# EAGLE design G228 (EAGLE 4.11)
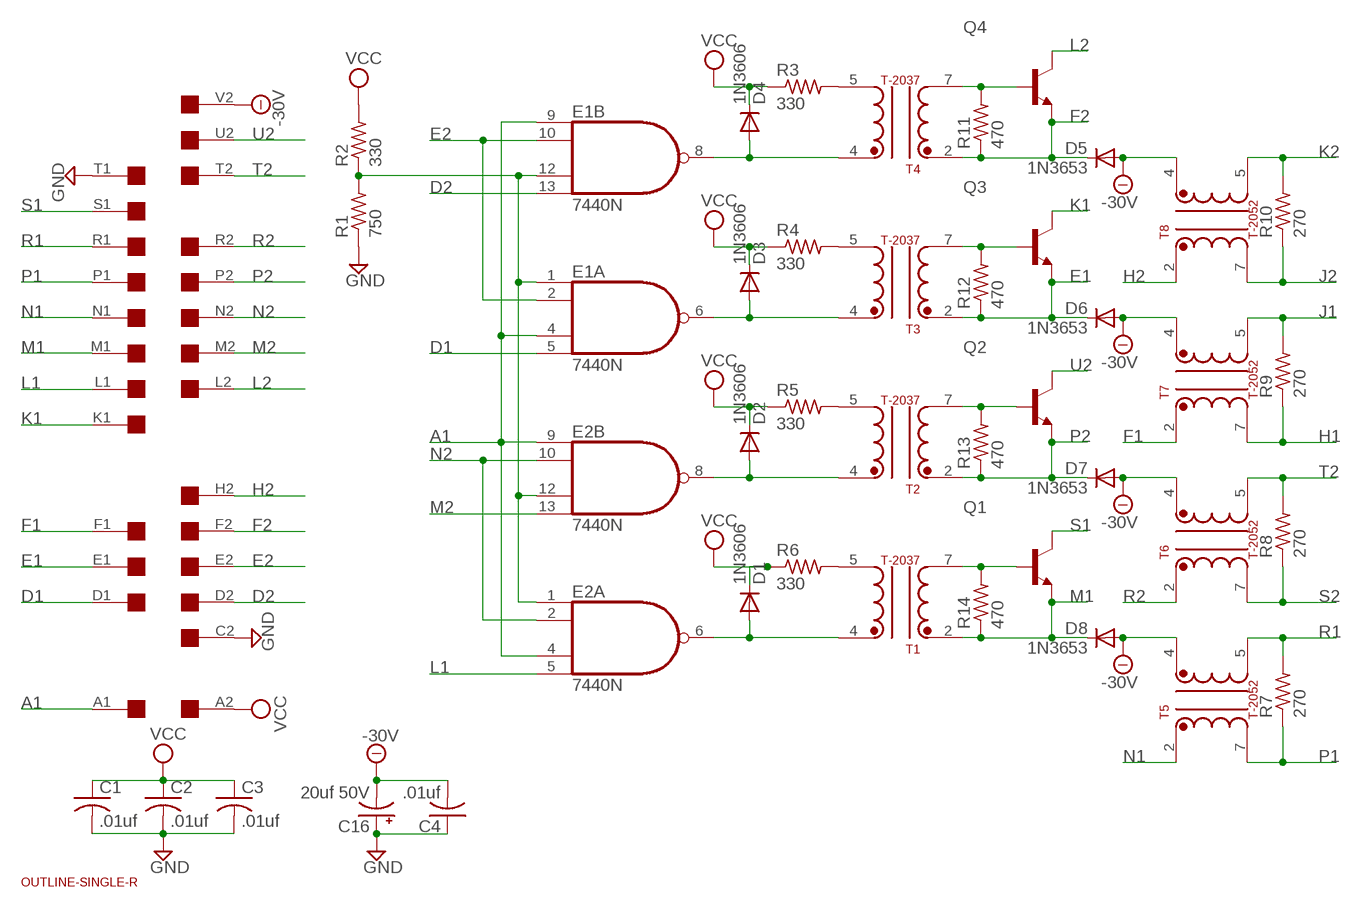
[diagram p0: schematic, sheet 1]

## Parts
C1  .01uf  C-US050-025X075  [C050-025X075]
C2  .01uf  C-US050-025X075  [C050-025X075]
C3  .01uf  C-US050-025X075  [C050-025X075]
C4  .01uf  C-US050-025X075  [C050-025X075]
C16  20uf 50V  CPOL-USE15-5AXIAL  [E15-5]
D1  1N3606  1N4148  [DO35-10]
D2  1N3606  1N4148  [DO35-10]
D3  1N3606  1N4148  [DO35-10]
D4  1N3606  1N4148  [DO35-10]
D5  1N3653  1N4148  [DO35-10]
D6  1N3653  1N4148  [DO35-10]
D7  1N3653  1N4148  [DO35-10]
D8  1N3653  1N4148  [DO35-10]
E1  7440N  74S20N  [DIL14]
E2  7440N  74S20N  [DIL14]
Q1  2N1613-NPN-TO39-EBC  [TO39]
Q2  2N1613-NPN-TO39-EBC  [TO39]
Q3  2N1613-NPN-TO39-EBC  [TO39]
Q4  2N1613-NPN-TO39-EBC  [TO39]
R1  750  R-US_0207/10  [0207/10]
R2  330  R-US_0207/10  [0207/10]
R3  330  R-US_0207/10  [0207/10]
R4  330  R-US_0207/10  [0207/10]
R5  330  R-US_0207/10  [0207/10]
R6  330  R-US_0207/10  [0207/10]
R7  270  R-US_0207/10  [0207/10]
R8  270  R-US_0207/10  [0207/10]
R9  270  R-US_0207/10  [0207/10]
R10  270  R-US_0207/10  [0207/10]
R11  470  R-US_0207/10  [0207/10]
R12  470  R-US_0207/10  [0207/10]
R13  470  R-US_0207/10  [0207/10]
R14  470  R-US_0207/10  [0207/10]
T1  T-2037  [TRANSFORMER]
T2  T-2037  [TRANSFORMER]
T3  T-2037  [TRANSFORMER]
T4  T-2037  [TRANSFORMER]
T5  T-2052  [TRANSFORMER]
T6  T-2052  [TRANSFORMER]
T7  T-2052  [TRANSFORMER]
T8  T-2052  [TRANSFORMER]
U$1  SINGLE  [EDGE-CON2]
U$2  OUTLINE-SINGLE-R  [SINGLE-R]

## Nets
-24V [supply]: C4.2 C16.- D5.A D6.A D7.A D8.A T5.4 T6.4 T7.4 T8.4 U$1.V2 ; supply symbol labelled -30V
A1: E1.4(A:I2) E1.9(B:I0) E2.4(A:I2) E2.9(B:I0) U$1.A1
D1: E1.5(A:I3) U$1.D1
D2: E1.13(B:I3) U$1.D2
E1: D6.C Q3.1(E) R12.1 T3.2 U$1.E1
E2: E1.2(A:I1) E1.10(B:I1) U$1.E2
F1: T7.2 U$1.F1
F2: D5.C Q4.1(E) R11.1 T4.2 U$1.F2
GND [supply]: C1.2 C2.2 C3.2 C4.1 C16.+ R1.1 U$1.C2 U$1.T1
H1: R9.1 T7.7
H2: T8.2 U$1.H2
J1: R9.2 T7.5
J2: R10.1 T8.7
K1: Q3.3(C) U$1.K1
K2: R10.2 T8.5
L1: E2.5(A:I3) U$1.L1
L2: Q4.3(C) U$1.L2
M1: D8.C Q1.1(E) R14.1 T1.2 U$1.M1
M2: E2.13(B:I3) U$1.M2
N1: T5.2 U$1.N1
N2: E2.2(A:I1) E2.10(B:I1) U$1.N2
N$1: E1.1(A:I0) E1.12(B:I2) E2.1(A:I0) E2.12(B:I2) R1.2 R2.1
N$2: D1.A E2.6(A:O) T1.4
N$3: D2.A E2.8(B:O) T2.4
N$4: D3.A E1.6(A:O) T3.4
N$5: D4.A E1.8(B:O) T4.4
N$6: R6.2 T1.5
N$7: R5.2 T2.5
N$8: R4.2 T3.5
N$9: R3.2 T4.5
N$10: Q4.2(B) R11.2 T4.7
N$12: Q3.2(B) R12.2 T3.7
N$14: Q2.2(B) R13.2 T2.7
N$16: Q1.2(B) R14.2 T1.7
P1: R7.1 T5.7 U$1.P1
P2: D7.C Q2.1(E) R13.1 T2.2 U$1.P2
R1: R7.2 T5.5 U$1.R1
R2: T6.2 U$1.R2
S1: Q1.3(C) U$1.S1
S2: R8.1 T6.7
T2: R8.2 T6.5 U$1.T2
U2: Q2.3(C) U$1.U2
VCC [supply]: C1.1 C2.1 C3.1 D1.C D2.C D3.C D4.C R2.2 R3.1 R4.1 R5.1 R6.1 U$1.A2
Unconnected: U$1.B1 U$1.B2 U$1.C1 U$1.H1 U$1.J1 U$1.J2 U$1.K2 U$1.S2 U$1.U1 U$1.V1

## Power pins joined to a net without a drawn wire
GND: E1.7(P:GND) E2.7(P:GND)
VCC: E1.14(P:VCC) E2.14(P:VCC)

## Library data of the parts
C1-C4 = rcl:C-US: CAPACITOR, American symbol
C16 = rcl:CPOL-US: POLARIZED CAPACITOR, American symbol
D1-D8 = diode:1N4148: DIODE high speed (Philips)
E1 E2 = 74xx-us:74*20: Dual 4-input NAND gate
Q1-Q4 = transistor:*-NPN-: NPN Transistror
R1-R14 = rcl:R-US_: RESISTOR, American symbol
T1-T4 = dec-con:T-2037: T-2037 Transformer
T5-T8 = dec-con:T-2052: T-2037 Transformer
U$1 = dec-con:SINGLE: Double-Height DEC board
U$2 = dec-con:OUTLINE-*: Board outlines for DEC boards.

## Net classes
1 supply: width 0.762 mm, drill 0.508 mm

## Board
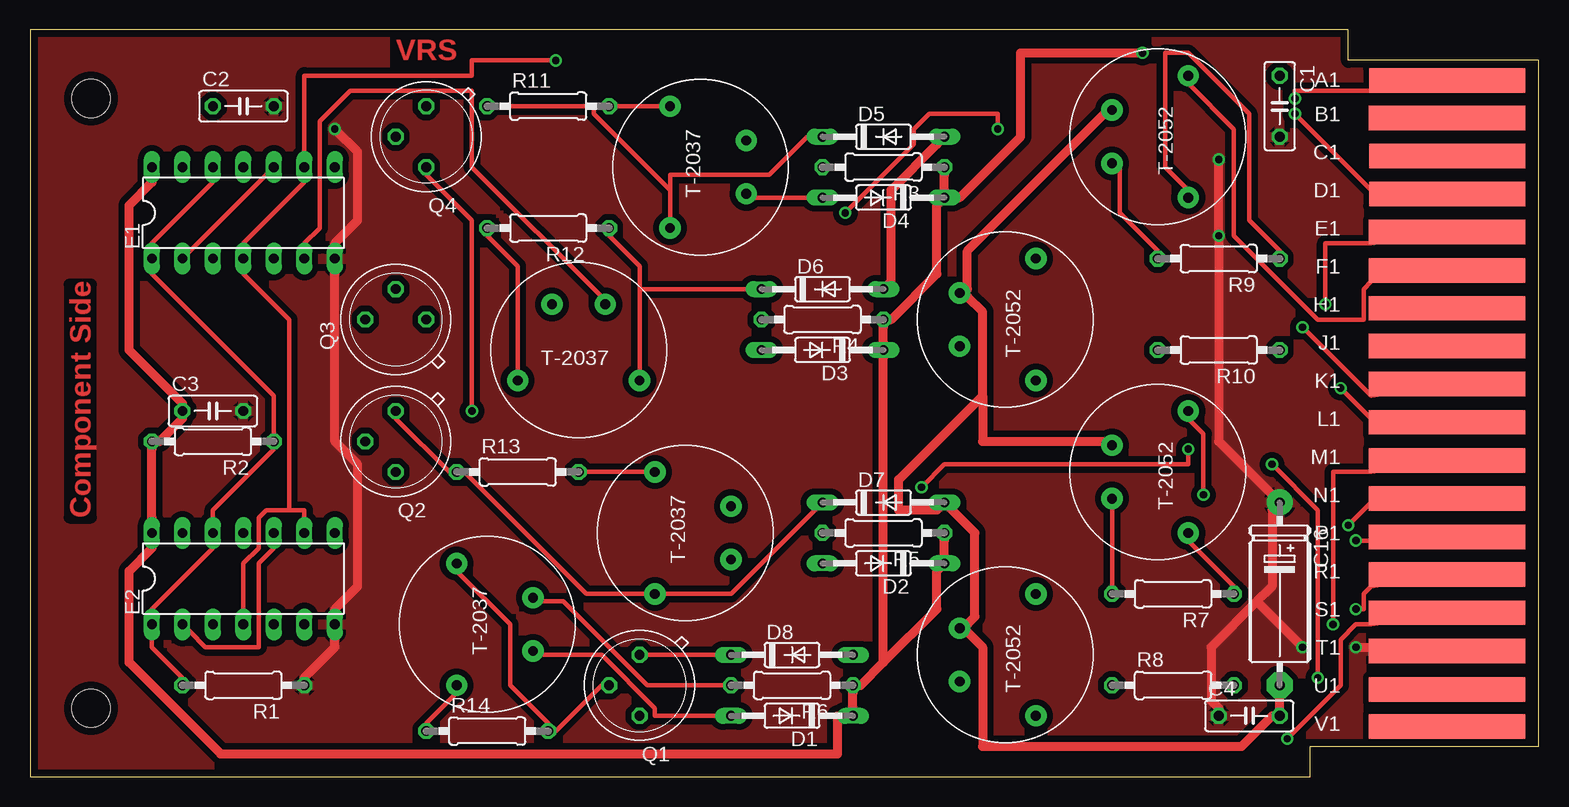
[diagram p1: board, top side]
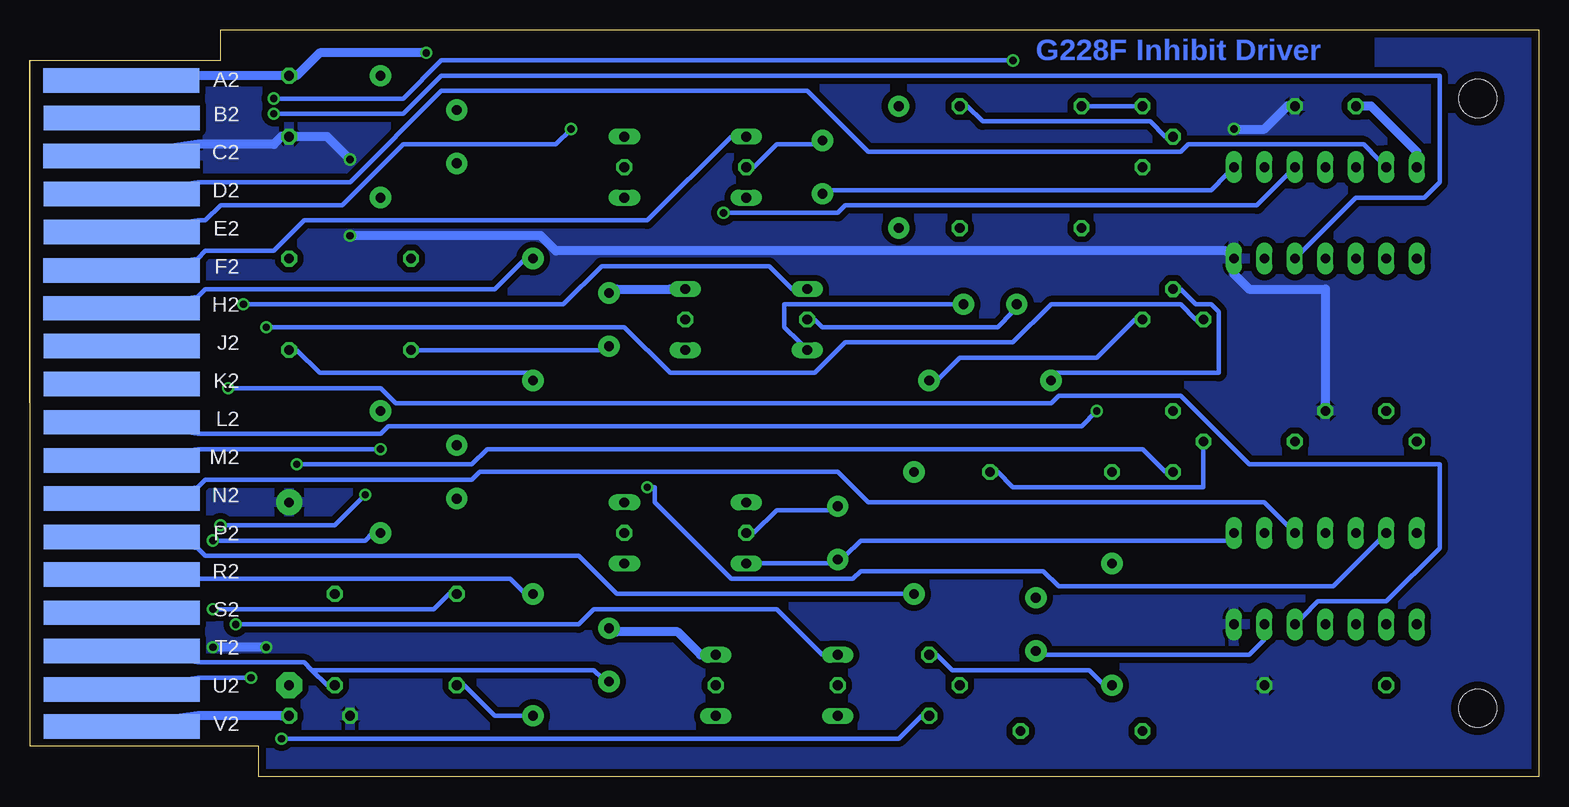
[diagram p2: board, bottom side, seen from below]

Size 125.73 x 62.23 mm. Coordinates in mm from the lower left corner, seen from the top.
Copper layers (1*16): Top 0.035mm / dielectric 1.5mm / Bottom 0.035mm
Design rules "15mils": minimum track width 15mil, minimum drill 24mil, track to track 15mil, track to pad 10mil, pad to pad 10mil, via to via 10mil, smd to smd 10mil, copper to edge 25mil, drill to drill 10mil, minimum pad ring 10mil, minimum via ring 8mil, stop-mask expansion 0mil, vias tented up to drill 0mil, thermal gap 10mil

### Footprints (pad centres in the part's own frame; a part is rotated, then mirrored left to right if it is on the bottom)
C050-025X075 = drill 0.813 octagon: 1 -2.54,0; 2 2.54,0
E15-5 = drill 0.813 pad 2.159: + -7.62,0 | drill 0.813 pad 2.159 octagon: - 7.62,0
DO35-10 = drill 0.813 long: A 5.08,0; C -5.08,0
DIL14 = drill 0.813 long: 1 -7.62,-3.81; 2 -5.08,-3.81; 3 -2.54,-3.81; 4 0,-3.81; 5 2.54,-3.81; 6 5.08,-3.81; 7 7.62,-3.81; 8 7.62,3.81; 9 5.08,3.81; 10 2.54,3.81; 11 0,3.81; 12 -2.54,3.81; 13 -5.08,3.81; 14 -7.62,3.81
TO39 = drill 0.813 octagon: 1 0,-2.54; 2 2.54,0; 3 0,2.54
0207/10 = drill 0.813 octagon: 1 -5.08,0; 2 5.08,0
TRANSFORMER = drill 0.813 pad 1.778: 2 -5.08,2.54; 4 -2.223,-3.81; 5 2.223,-3.81; 7 5.08,2.54
EDGE-CON2 = smd 13.017 x 2.032: A1 7.633,4.207; B1 7.639,7.327; C1 7.636,10.489; D1 7.633,13.665; E1 7.642,16.84; F1 7.642,20.041; H1 7.642,23.19; J1 7.642,26.34; K1 7.642,29.515; L1 7.642,32.69; M1 7.642,35.89; N1 7.642,39.04; P1 7.642,42.24; R1 7.642,45.39; S1 7.642,48.565; T1 7.642,51.74; U1 7.642,54.966; V1 7.642,58.026 | smd 13.017 x 2.032 bottom: A2 7.614,4.207; B2 7.642,7.328; C2 7.617,10.49; D2 7.642,13.665; E2 7.642,16.84; F2 7.617,20.041; H2 7.617,23.19; J2 7.642,26.34; K2 7.642,29.515; L2 7.642,32.69; M2 7.642,35.89; N2 7.642,39.04; P2 7.642,42.24; R2 7.642,45.39; S2 7.642,48.565; T2 7.642,51.74; U2 7.642,54.966; V2 7.642,58.026
SINGLE-R = hole 3.175: 5.08,5.715; 5.08,56.515

### Placement (x,y rotation side)
C1  104.14,55.88 270 top
C2  17.78,55.88 0 top
C3  15.24,30.48 0 top
C4  101.6,5.08 0 top
C16  104.14,15.24 270 top
D1  63.5,5.08 180 top
D2  71.12,17.78 180 top
D3  66.04,35.56 180 top
D4  71.12,48.26 180 top
D5  71.12,53.34 0 top
D6  66.04,40.64 0 top
D7  71.12,22.86 0 top
D8  63.5,10.16 0 top
E1  17.78,46.99 0 top
E2  17.78,16.51 0 top
Q1  50.8,7.62 180 top
Q2  30.48,27.94 180 top
Q3  30.48,38.1 90 top
Q4  33.02,53.34 180 top
R1  17.78,7.62 180 top
R2  15.24,27.94 180 top
R3  71.12,50.8 180 top
R4  66.04,38.1 180 top
R5  71.12,20.32 180 top
R6  63.5,7.62 180 top
R7  95.25,15.24 180 top
R8  95.25,7.62 0 top
R9  99.06,43.18 180 top
R10  99.06,35.56 180 top
R11  43.18,55.88 0 top
R12  43.18,45.72 180 top
R13  40.64,25.4 0 top
R14  38.1,3.81 0 top
T1  38.1,12.7 90 top
T2  54.61,20.32 90 top
T3  45.72,35.56 180 top
T4  55.88,50.8 90 top
T5  93.98,25.4 270 top
T6  81.28,10.16 270 top
T7  93.98,53.34 270 top
T8  81.28,38.1 270 top
U$1  125.73,62.23 180 top
U$2  0,0 0 top

### Tracks (layer width: path | path; a pad name or v marks a point on that pad's centre or on a via)
-24V
  Top 0.762: C16.- 104.14,6.99 104.14,5.71 C4.2 103.5,5.08 100.97,2.54 79.38,2.54 79.38,10.79 78.11,12.06 T6.4 78.11,12.7 78.74,13.34 78.74,20.32 76.83,22.23 D7.A 75.56,22.23 72.39,22.23 72.39,24.77 79.38,31.75 | D5.A 75.56,52.7 71.75,48.9 71.75,41.27 D6.A | 79.38,31.75 79.38,38.73 78.11,40.01 T8.4 78.11,40.64 78.11,43.81 89.53,55.24 T7.4 | 79.38,31.75 79.38,27.94 89.53,27.94 T5.4
  Bottom 0.762: C4.2 104.78,5.08 111.76,5.08 U$1.V2 | D8.A 69.85,10.16 71.75,12.06 76.83,12.06 T6.4 | D6.A 72.39,40.64 76.83,40.64 T8.4
A1  (via drill 0.61)
  Top 0.381: 21.59,22.23 22.86,22.23 22.86,21.59 E2.9 | 21.59,22.23 19.68,22.23 19.05,21.59 19.05,19.05 17.78,17.78 17.78,13.97 E2.4 | 21.59,22.23 21.59,38.1 17.78,41.91 E1.4 17.78,44.45 22.86,49.53 E1.9 22.86,52.07 22.86,58.42 36.83,58.42 36.83,59.69 v43.81,59.69 | v105.41,56.52 105.41,57.15 111.76,57.15 U$1.A1
  Bottom 0.381: v105.41,56.52 94.61,56.52 91.44,59.69 v43.81,59.69
D1  (via drill 0.61)
  Top 0.381: v105.41,55.24 111.76,48.9 U$1.D1
  Bottom 0.381: v105.41,55.24 94.61,55.24 91.44,58.42 8.26,58.42 8.26,49.53 9.53,48.26 15.24,48.26 19.68,43.81 E1.5
D2
  Bottom 0.381: E1.13 13.34,51.44 14.61,52.7 29.21,52.7 29.84,52.07 55.88,52.07 60.96,57.15 91.44,57.15 99.06,49.53 111.76,49.53 U$1.D2
E1  (via drill 0.61)
  Top 0.381: 50.8,40.64 50.8,33.66 T3.2 | 50.8,40.64 50.8,42.55 48.26,45.09 R12.1 | 50.8,40.64 59.69,40.64 D6.C | v107.95,39.37 107.95,44.45 111.76,44.45 U$1.E1
  Bottom 0.381: Q3.1 33.66,38.1 36.83,34.92 48.26,34.92 50.16,33.02 T3.2 | v107.95,39.37 81.28,39.37 78.11,42.55 64.14,42.55 62.23,40.64 D6.C
E2  (via drill 0.61)
  Top 0.381: E1.2 13.34,43.81 19.68,50.16 E1.10 | v67.94,46.99 73.66,52.7 73.66,53.98 74.93,55.24 80.64,55.24 v80.64,53.98
  Bottom 0.381: v67.94,46.99 58.42,46.99 57.78,47.62 23.5,47.62 20.95,50.16 E1.10 | v80.64,53.98 81.92,52.7 94.61,52.7 99.69,47.62 109.86,47.62 111.12,46.35 111.76,46.35 U$1.E2
F1
  Top 0.381: T7.2 96.52,57.78 100.33,53.98 100.33,45.09 107.31,38.1 111.12,38.1 111.12,40.64 111.76,41.27 U$1.F1
F2
  Top 0.381: 53.34,48.9 53.34,46.35 T4.2 | 53.34,48.9 53.34,50.16 61.59,50.16 64.77,53.34 D5.C | 53.34,48.9 46.99,55.24 46.99,55.88 38.73,55.88 R11.1
  Bottom 0.381: Q4.1 33.66,55.88 37.47,55.88 R11.1 | U$1.F2 111.76,43.18 111.12,43.81 105.41,43.81 102.87,46.35 74.3,46.35 67.31,53.34 D5.C
GND  (via drill 0.61)
  Top 0.762: R1.1 22.86,8.26 25.4,10.79 25.4,11.43 E2.7 25.4,13.97 27.3,15.88 27.3,26.04 25.4,27.94 25.4,41.91 E1.7 25.4,44.45 27.3,46.35 27.3,52.07 v25.4,53.98 | 102.23,14.61 103.5,15.88 103.5,22.23 C16.+ 103.5,23.5 99.06,27.94 v99.06,45.09 v99.06,51.44 | 102.23,14.61 98.42,10.79 98.42,6.35 99.06,5.71 C4.1 | v110.49,10.79 111.76,10.79 U$1.T1 | 102.23,14.61 v106.05,10.79
  Bottom 0.762: C3.2 17.78,31.11 17.78,40.64 24.13,40.64 25.4,41.91 E1.7 26.04,43.81 81.92,43.81 83.19,45.09 v99.06,45.09 | v25.4,53.98 22.86,53.98 20.95,55.88 C2.2 | U$1.C2 111.76,52.7 105.41,52.7 104.78,53.34 C1.2 103.5,53.34 100.97,53.34 v99.06,51.44 | v106.05,10.79 v110.49,10.79
  pour Bottom: 0,62.23 111.76,62.23 111.76,0 0,0
  pour Top: 0,62.23 111.76,62.23 111.76,0 0,0
H1
  Top 0.381: R9.1 104.14,43.81 101.6,46.35 101.6,55.24 96.52,60.33 94.61,60.33 94.61,50.8 96.52,48.9 T7.7
H2
  Bottom 0.381: T8.2 84.45,43.18 87,40.64 111.12,40.64 111.76,40.01 U$1.H2
J1
  Top 0.381: R9.2 93.98,43.81 90.81,46.99 90.81,50.8 T7.5
J2
  Bottom 0.381: R10.1 103.5,35.56 101.6,33.66 83.82,33.66 T8.7
K1  (via drill 0.61)
  Top 0.381: v106.05,37.47 111.76,31.75 U$1.K1
  Bottom 0.381: v106.05,37.47 76.2,37.47 72.39,33.66 60.33,33.66 57.78,36.2 43.81,36.2 40.64,39.37 29.84,39.37 28.57,38.1 Q3.3
K2
  Bottom 0.381: R10.2 93.34,35.56 78.11,35.56 T8.5
L1  (via drill 0.61)
  Top 0.381: v109.22,32.38 111.76,29.84 U$1.L1
  Bottom 0.381: v109.22,32.38 96.52,32.38 95.25,31.11 40.64,31.11 40.01,31.75 29.84,31.75 24.13,26.04 8.26,26.04 8.26,19.05 12.7,14.61 18.41,14.61 19.68,13.34 E2.5
L2  (via drill 0.61)
  Top 0.381: v36.83,30.48 36.83,46.35 33.02,50.16 Q4.3
  Bottom 0.381: v36.83,30.48 38.1,29.21 95.89,29.21 96.52,28.57 111.76,28.57 U$1.L2
M1  (via drill 0.61)
  Top 0.381: Q1.1 51.44,10.16 57.15,10.16 D8.C | R14.1 33.02,4.45 35.56,6.99 T1.2 | v108.58,12.7 108.58,25.4 111.76,25.4 U$1.M1
  Bottom 0.381: Q1.1 50.16,10.16 48.9,8.89 37.47,8.89 36.2,7.62 T1.2 | v108.58,12.7 80.01,12.7 78.74,13.97 63.5,13.97 59.69,10.16 D8.C
M2  (via drill 0.61)
  Top 0.381: v74.3,24.13 76.2,26.04 96.52,26.04 v96.52,27.3
  Bottom 0.381: v74.3,24.13 73.66,24.13 73.66,22.86 67.31,16.51 57.15,16.51 56.52,17.14 41.27,17.14 40.01,15.88 17.14,15.88 13.34,19.68 E2.13 | v96.52,27.3 111.76,27.3 U$1.M2
N1  (via drill 0.61)
  Top 0.381: v97.79,23.5 97.79,28.57 96.52,29.84 T5.2 | v109.86,20.95 111.76,22.86 U$1.N1
  Bottom 0.381: v97.79,23.5 100.33,20.95 v109.86,20.95
N2
  Top 0.381: E2.2 13.34,12.06 14.61,10.79 19.05,10.79 19.05,17.78 20.32,19.05 E2.10
  Bottom 0.381: E2.10 20.95,20.95 22.86,22.86 55.88,22.86 58.42,25.4 88.27,25.4 88.9,24.77 111.12,24.77 111.76,24.13 U$1.N2
N$1
  Top 0.381: E1.12 15.24,49.53 10.16,44.45 E1.1 10.16,41.91 20.32,31.75 20.32,28.57 R2.1 20.32,27.3 15.24,22.23 15.24,21.59 E2.12 15.24,19.05 10.16,13.97 E2.1 10.16,11.43 10.16,10.79 12.7,8.26 R1.2
N$2
  Top 0.381: D1.A 57.15,5.08 52.07,5.08 52.07,5.71 47.62,10.16 42.55,10.16 T1.4
  Bottom 0.381: E2.6 22.86,11.43 24.13,10.16 41.27,10.16 T1.4
N$3
  Bottom 0.381: E2.8 26.04,19.68 56.52,19.68 57.78,18.41 T2.4 59.05,17.78 64.77,17.78 D2.A
N$4
  Top 0.381: E1.6 22.86,44.45 24.13,45.72 24.13,54.61 26.67,57.15 36.83,57.15 36.83,50.8 47.62,40.01 T3.4
  Bottom 0.381: D3.A 61.59,36.2 62.87,37.47 62.87,39.37 48.26,39.37 T3.4
N$5
  Top 0.381: D4.A 64.77,48.26 60.33,48.26 T4.4
  Bottom 0.381: E1.8 26.04,50.16 27.3,48.9 59.05,48.9 T4.4
N$6
  Top 0.381: R6.2 57.78,7.62 51.44,7.62 44.45,14.61 42.55,14.61 T1.5
N$7
  Bottom 0.381: R5.2 65.41,20.32 63.5,22.23 59.05,22.23 T2.5
N$8
  Bottom 0.381: R4.2 60.33,38.1 59.69,37.47 45.09,37.47 43.81,38.73 T3.5
N$9
  Bottom 0.381: R3.2 65.41,50.8 63.5,52.7 60.33,52.7 T4.5
N$10
  Top 0.381: T4.7 52.7,55.88 48.9,55.88 R11.2
  Bottom 0.381: Q4.2 31.11,53.34 32.38,54.61 46.35,54.61 47.62,55.88 R11.2
N$12
  Top 0.381: R12.2 38.1,45.09 40.64,42.55 40.64,33.66 T3.7
  Bottom 0.381: Q3.2 29.84,40.64 28.57,39.37 27.3,39.37 26.67,38.73 26.67,33.66 40.64,33.66 T3.7
N$14
  Top 0.381: T2.7 51.44,25.4 46.35,25.4 R13.2
  Bottom 0.381: Q2.2 27.94,27.3 27.94,24.13 43.81,24.13 45.09,25.4 R13.2
N$16
  Top 0.381: Q1.2 47.62,7.62 43.81,3.81 R14.2 43.18,4.45 40.01,7.62 40.01,12.7 35.56,17.14 T1.7
P1  (via drill 0.61)
  Top 0.381: R7.1 100.33,15.88 96.52,19.68 T5.7 | v110.49,19.68 111.76,19.68 U$1.P1
  Bottom 0.381: v110.49,19.68 97.79,19.68 97.16,20.32 T5.7
P2
  Top 0.381: Q2.1 30.48,29.84 34.92,25.4 R13.1 36.2,25.4 46.35,15.24 51.44,15.24 T2.2 52.7,15.24 58.42,15.24 65.41,22.23 D7.C
  Bottom 0.381: U$1.P2 111.76,19.05 111.12,18.41 80.01,18.41 76.83,15.24 52.7,15.24 T2.2
R1  (via drill 0.61)
  Top 0.381: R7.2 90.17,15.88 90.17,22.86 T5.5 | v110.49,13.97 111.12,13.97 111.12,15.24 111.76,15.88 U$1.R1
  Bottom 0.381: v110.49,13.97 92.08,13.97 90.81,15.24 R7.2
R2
  Bottom 0.381: T6.2 84.45,15.24 85.72,16.51 111.76,16.51 U$1.R2
S1  (via drill 0.61)
  Top 0.381: v104.78,3.17 109.22,7.62 109.22,11.43 110.49,12.7 111.76,12.7 U$1.S1
  Bottom 0.381: v104.78,3.17 53.34,3.17 51.44,5.08 Q1.3
S2
  Bottom 0.381: R8.1 89.53,7.62 87,5.08 84.45,5.08 T6.7
T2
  Bottom 0.381: 102.23,8.89 102.87,9.53 111.76,9.53 U$1.T2 | 102.23,8.89 100.97,7.62 R8.2 | 102.23,8.89 78.74,8.89 78.11,8.26 T6.5
U2  (via drill 0.61)
  Top 0.381: v103.5,26.04 107.31,22.23 v107.31,8.26
  Bottom 0.381: v103.5,26.04 88.9,26.04 87.63,27.3 33.02,27.3 31.11,25.4 Q2.3 | v107.31,8.26 111.76,8.26 U$1.U2
VCC  (via drill 0.61)
  Top 0.762: E1.14 10.16,49.53 8.26,47.62 8.26,35.56 12.7,31.11 C3.1 12.7,29.84 10.79,27.94 R2.2 10.16,27.3 10.16,21.59 E2.14 10.16,19.05 8.26,17.14 8.26,9.53 15.88,1.91 67.31,1.91 67.31,5.08 D1.C 68.58,5.71 68.58,6.99 R6.1 69.22,7.62 71.12,9.53 | D4.C 76.2,48.9 76.2,50.16 R3.1 | D4.C 75.56,47.62 75.56,41.91 71.75,38.1 R4.1 71.12,37.47 71.12,36.2 D3.C 71.12,34.92 71.12,9.53 | R5.1 76.2,19.68 76.2,18.41 D2.C 75.56,17.14 75.56,13.97 71.12,9.53 | v92.71,60.33 82.55,60.33 82.55,53.34 77.47,48.26 D4.C
  Bottom 0.762: E1.14 10.16,52.07 13.97,55.88 14.61,55.88 C2.1 | U$1.A2 111.76,58.42 104.78,58.42 C1.1 103.5,58.42 101.6,60.33 v92.71,60.33

### Text on the board
Top: VRS | Component Side
Bottom: G228F Inhibit Driver